# Altium schematic sheet Jacks.SchDoc
size C; SheetNumber: 1; SheetTotal: 1
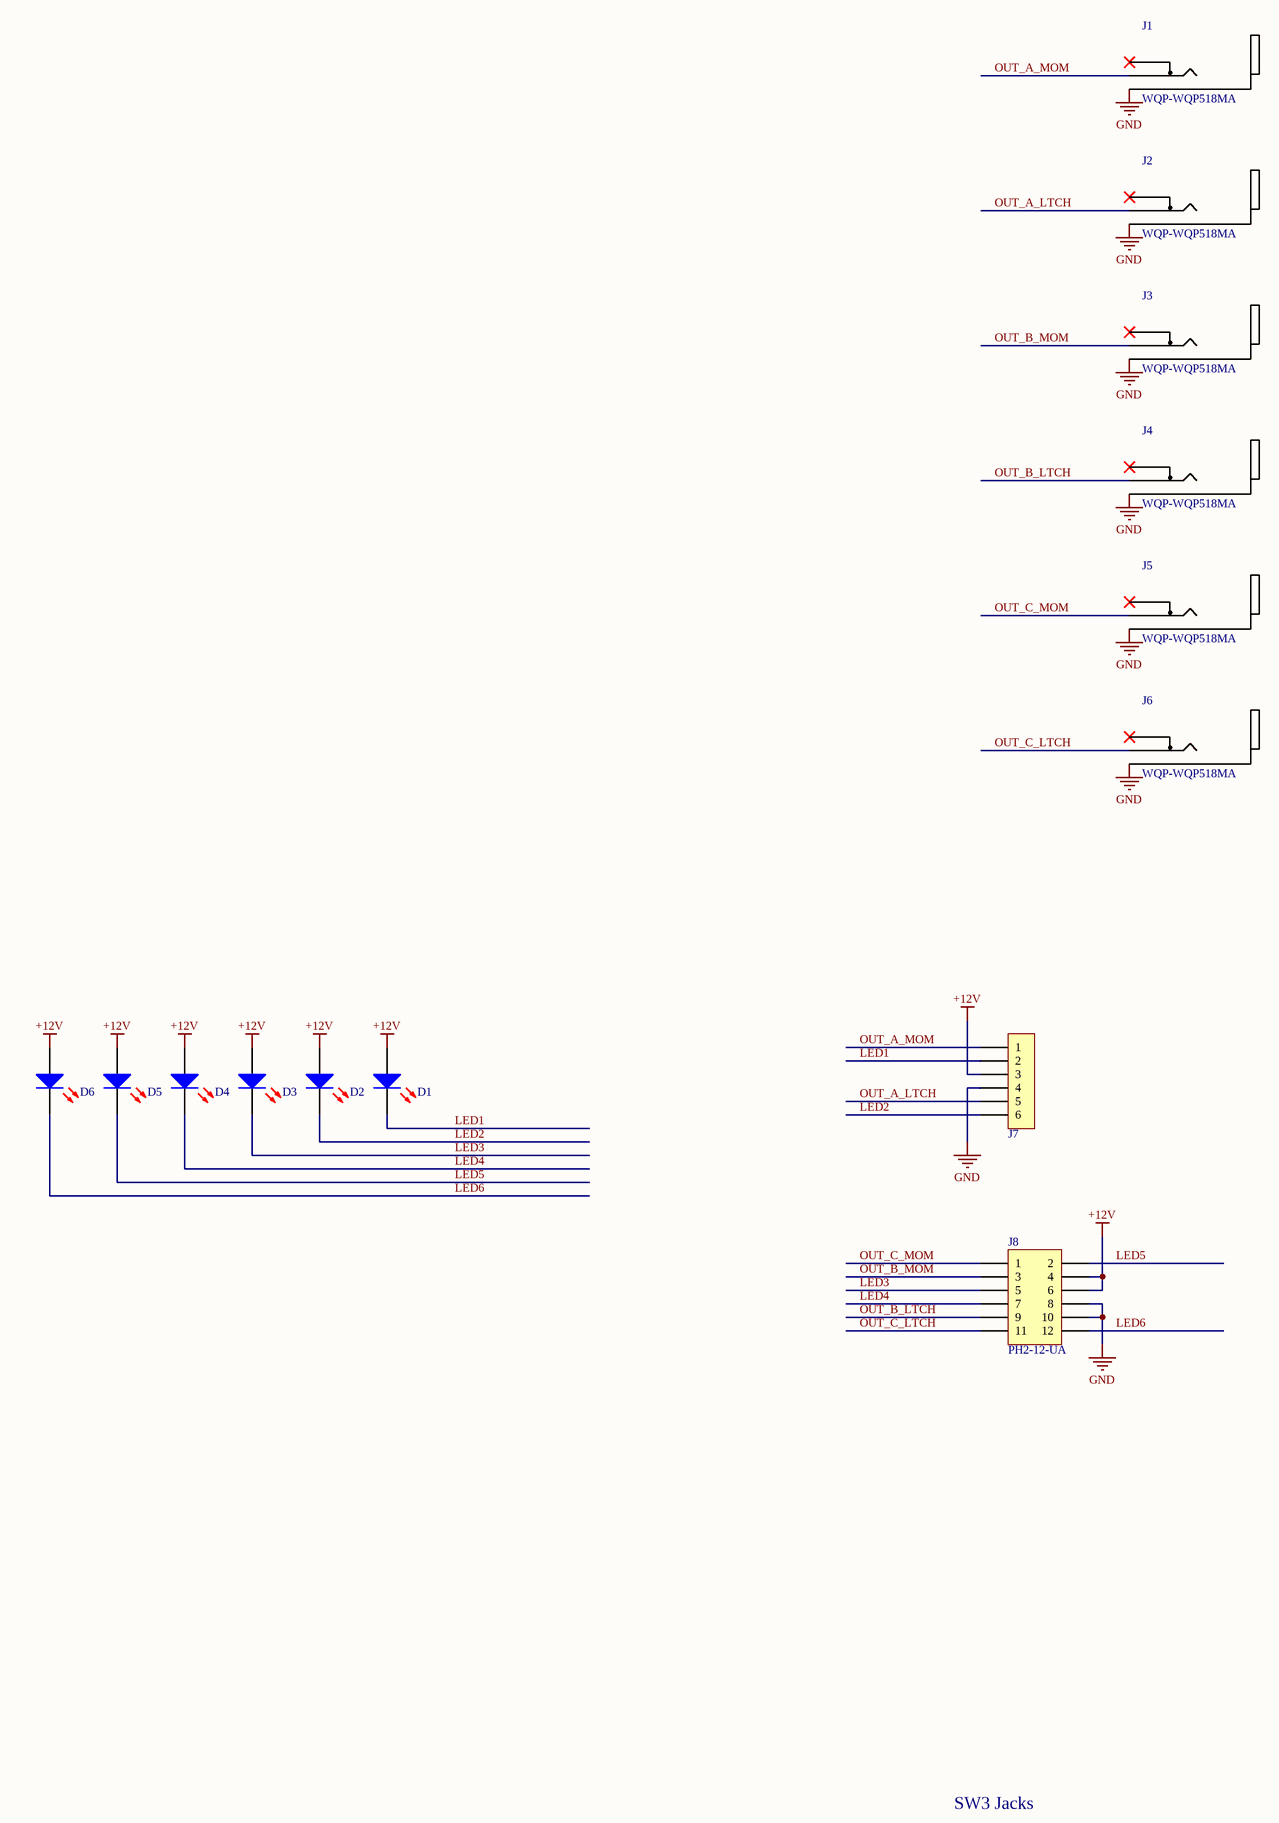
[diagram p0: Jacks.SchDoc]

## Parts
D1  RED  [LED_3mm_TH]  (value not drawn)
D2  RED  [LED_3mm_TH]  (value not drawn)
D3  RED  [LED_3mm_TH]  (value not drawn)
D4  RED  [LED_3mm_TH]  (value not drawn)
D5  RED  [LED_3mm_TH]  (value not drawn)
D6  RED  [LED_3mm_TH]  (value not drawn)
J1  WQP-WQP518MA  [PJ301M-12]
J2  WQP-WQP518MA  [PJ301M-12]
J3  WQP-WQP518MA  [PJ301M-12]
J4  WQP-WQP518MA  [PJ301M-12]
J5  WQP-WQP518MA  [PJ301M-12]
J6  WQP-WQP518MA  [PJ301M-12]
J7  PH1-06-UA  [ADAM_TECH_PH1-06-UA]  (value not drawn)
J8  PH2-12-UA  [ADAM_TECH_PH2-12-UA]

## Nets
+12V: D1.1(A) D2.1(A) D3.1(A) D4.1(A) D5.1(A) D6.1(A) J7.3 J8.4 J8.6
GND: J1.1 J2.1 J3.1 J4.1 J5.1 J6.1 J7.4 J8.8 J8.10
LED1: D1.2(C) J7.2
LED2: D2.2(C) J7.6
LED3: D3.2(C) J8.5
LED4: D4.2(C) J8.7
LED5: D5.2(C) J8.2
LED6: D6.2(C) J8.12
OUT_A_LTCH: J2.3 J7.5
OUT_A_MOM: J1.3 J7.1
OUT_B_LTCH: J4.3 J8.9
OUT_B_MOM: J3.3 J8.3
OUT_C_LTCH: J6.3 J8.11
OUT_C_MOM: J5.3 J8.1

Not connected (* = marked no-connect by the designer): J1 2*; J2 2*; J3 2*; J4 2*; J5 2*; J6 2*

## Notes on the sheet
- SW3 Jacks
- Title:
- This work is licensed under a Creative Commons Attribution 4.0 International License. Derivative works should remove all Sophistry branding and ‘é’ watermark.
- Date:
- Engineer:
- Revision:
- Codename:
- Time:
- Variant:
- Sheet
- of

## Library data of the parts
D1-D6 = 151033RS03000: LED RED CLEAR 3MM ROUND T/H; Manufacturer: Würth Elektronik; PartNumber: 151033RS03000; Datasheets: https://www.we-online.com/katalog/datasheet/151033RS03000.pdf; Supplier 1: Digi-Key; Supplier Part Number 1: 732-5013-ND; Supplier 2: Mouser; Supplier Part Number 2: 710-151033RS03000; Manufacturer Part Number: 151033RS03000; Color: Red
J1-J6 = WQP-WQP518MA: CONN 3.5mm VIRTICAL MONO w/ NORMAL; Manufacturer: QingPu; Connector Type: Phone Jack; Gender: Female; PartNumber: WQP-WQP518MA; HelpURL: http://www.qingpu-electronics.com/en/products/WQP-PJ398SM-362.html; Supplier 1: QingPu; Supplier Part Number 1: WQP-WQP518MA; Manufacturer Part Number: WQP-WQP518MA; Signal Lines: Mono
J7 = PH1-06-UA: CONN HEADER VERT 6POS 2.54MM; Manufacturer: Adam Tech; PartNumber: PH1-06-UA; Supplier 1: Digi-Key; Supplier 2: Mouser; HelpURL: https://app.adam-tech.com/products/download/data_sheet/201605/ph1-xx-ua-data-sheet.pdf; Supplier Part Number 1: 2057-PH1-06-UA-ND; Manufacturer Part Number: PH1-06-UA
J8 = PH2-12-UA: CONN HEADER 12POS DUAL VERT PCB; Manufacturer: Adam Tech; PartNumber: PH2-12-UA; Supplier 1: Digi-Key; Supplier 2: Mouser; HelpURL: https://app.adam-tech.com/products/download/data_sheet/202065/ph2-xx-ua-data-sheet.pdf; Supplier Part Number 1: 2057-PH2-12-UA-ND; Manufacturer Part Number: PH2-12-UA